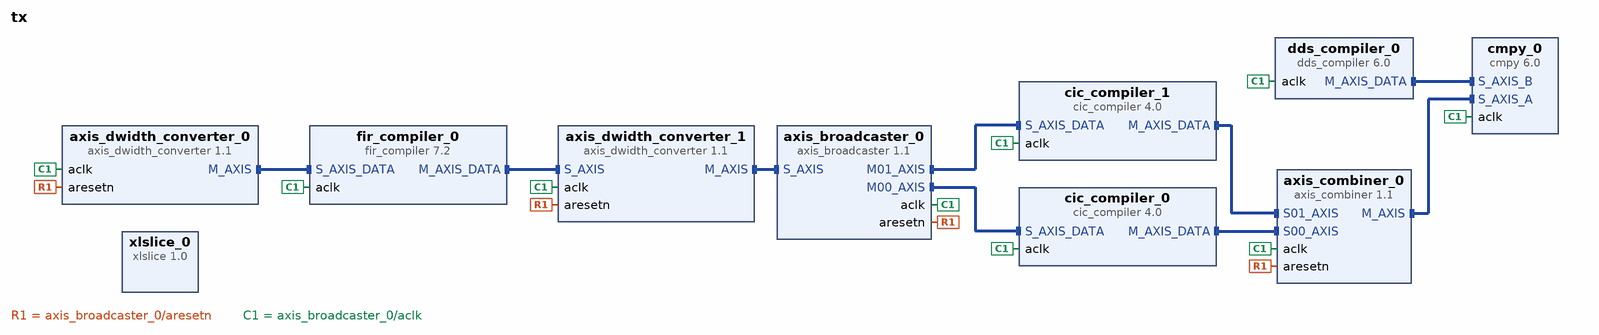
[diagram p0: block diagram of the top level]
# Vivado block design tx, xc7z020clg484-1, Vivado 2024.1
create_bd_design tx

create_bd_cell -type ip -vlnv xilinx.com:ip:fir_compiler:7.2 fir_compiler_0
create_bd_cell -type ip -vlnv xilinx.com:ip:axis_dwidth_converter:1.1 axis_dwidth_converter_0
create_bd_cell -type ip -vlnv xilinx.com:ip:axis_dwidth_converter:1.1 axis_dwidth_converter_1
create_bd_cell -type ip -vlnv xilinx.com:ip:axis_broadcaster:1.1 axis_broadcaster_0
create_bd_cell -type ip -vlnv xilinx.com:ip:cic_compiler:4.0 cic_compiler_0
create_bd_cell -type ip -vlnv xilinx.com:ip:cic_compiler:4.0 cic_compiler_1
create_bd_cell -type ip -vlnv xilinx.com:ip:axis_combiner:1.1 axis_combiner_0
create_bd_cell -type ip -vlnv xilinx.com:ip:dds_compiler:6.0 dds_compiler_0
set_property -dict [list \
  CONFIG.DATA_Has_TLAST Not_Required \
  CONFIG.Has_Phase_Out false \
  CONFIG.Latency 6 \
  CONFIG.M_DATA_Has_TUSER Not_Required \
  CONFIG.Noise_Shaping None \
  CONFIG.OUTPUT_FORM Twos_Complement \
  CONFIG.Output_Frequency1 0 \
  CONFIG.Output_Width 16 \
  CONFIG.PINC1 0 \
  CONFIG.Parameter_Entry Hardware_Parameters \
  CONFIG.PartsPresent SIN_COS_LUT_only \
  CONFIG.Phase_Width 16 \
  CONFIG.S_PHASE_Has_TUSER Not_Required \
] [get_bd_cells dds_compiler_0]
create_bd_cell -type ip -vlnv xilinx.com:ip:cmpy:6.0 cmpy_0
create_bd_cell -type ip -vlnv xilinx.com:ip:xlslice:1.0 xlslice_0

# ---- connections ----

connect_bd_intf_net [get_bd_intf_pins axis_broadcaster_0/M00_AXIS] [get_bd_intf_pins cic_compiler_0/S_AXIS_DATA]
connect_bd_intf_net [get_bd_intf_pins axis_broadcaster_0/M01_AXIS] [get_bd_intf_pins cic_compiler_1/S_AXIS_DATA]
connect_bd_intf_net [get_bd_intf_pins axis_combiner_0/M_AXIS] [get_bd_intf_pins cmpy_0/S_AXIS_A]
connect_bd_intf_net [get_bd_intf_pins axis_dwidth_converter_0/M_AXIS] [get_bd_intf_pins fir_compiler_0/S_AXIS_DATA]
connect_bd_intf_net [get_bd_intf_pins axis_dwidth_converter_1/M_AXIS] [get_bd_intf_pins axis_broadcaster_0/S_AXIS]
connect_bd_intf_net [get_bd_intf_pins cic_compiler_0/M_AXIS_DATA] [get_bd_intf_pins axis_combiner_0/S00_AXIS]
connect_bd_intf_net [get_bd_intf_pins cic_compiler_1/M_AXIS_DATA] [get_bd_intf_pins axis_combiner_0/S01_AXIS]
connect_bd_intf_net [get_bd_intf_pins dds_compiler_0/M_AXIS_DATA] [get_bd_intf_pins cmpy_0/S_AXIS_B]
connect_bd_intf_net [get_bd_intf_pins fir_compiler_0/M_AXIS_DATA] [get_bd_intf_pins axis_dwidth_converter_1/S_AXIS]
connect_bd_net [get_bd_pins axis_broadcaster_0/aresetn] \
  [get_bd_pins axis_dwidth_converter_1/aresetn] [get_bd_pins axis_dwidth_converter_0/aresetn] \
  [get_bd_pins axis_combiner_0/aresetn]
connect_bd_net [get_bd_pins axis_broadcaster_0/aclk] \
  [get_bd_pins axis_dwidth_converter_1/aclk] [get_bd_pins fir_compiler_0/aclk] [get_bd_pins axis_dwidth_converter_0/aclk] \
  [get_bd_pins cic_compiler_0/aclk] [get_bd_pins cic_compiler_1/aclk] [get_bd_pins axis_combiner_0/aclk] \
  [get_bd_pins dds_compiler_0/aclk] [get_bd_pins cmpy_0/aclk]

validate_bd_design
save_bd_design
